# Altium schematic sheet schematic.schdoc
size 307 x 218 mm; Symbol: Drawing-Symbol_A4; Device: Drawing-Symbol_A4; @Project Name: SophiePart1; @Page Count: 1; @Update Date: 2025-06-26; @Create Date: 2025-06-23; @Schematic Name: Schematic1; @Page No: 1; @Page Name: P1; Company: EasyEDA.com; Version: V1.0; Page Size: A4; @Create Time: 17:08:23; @Update Time: 13:48:41; Width: 1170; Height: 825; Region Start: 1; X Region Count: 6; Y Region Count: 4; Blade Width: 10; Title Block Position: 3; @Board Name: Board1
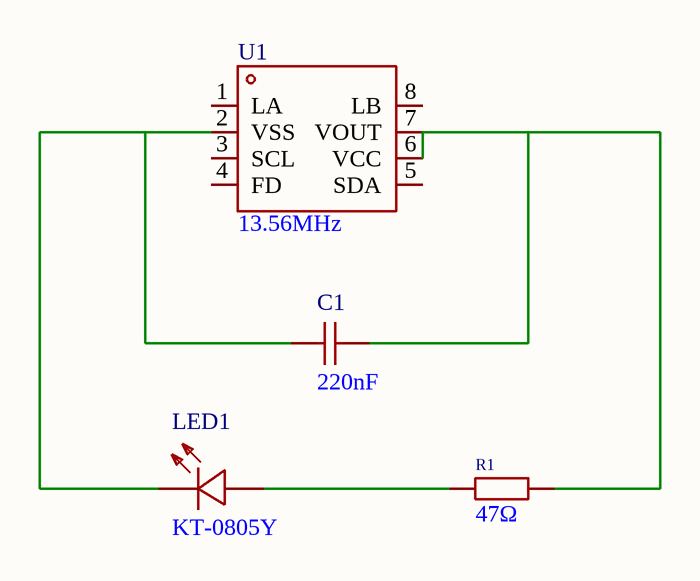
[diagram p0: schematic.schdoc]

## Parts
C1  220nF  [C0603]
LED1  KT-0805Y  [LED0805-R-RD]
R1  47Ω  [R0603]
U1  13.56MHz  [XQFN-8_L1.6-W1.6-P0.50-BL_NT3H2111W0FHKH]

## Nets
NetC1_1: C1.1 LED1.2(-) U1.2(VSS)
NetC1_2: C1.2 R1.2 U1.6(VCC) U1.7(VOUT)
NetLED1_1: LED1.1(+) R1.1

Not connected (* = marked no-connect by the designer): U1 1(LA) 3(SCL) 4(FD) 5(SDA) 8(LB)

## Notes on the sheet
- 1
- 2
- 3
- 4
- 5
- 6
- A
- B
- C
- Schematic
- Schematic1
- Create at
- Update at
- 2025-06-23
- 2025-06-26
- Board
- Drawn
- Board1
- Page
- P1
- D
- Reviewed
- Version
- Size
- SophiePart1
- Page  1  Total  1
- V1.0
- A4
- EasyEDA.com

## Library data of the parts
C1 = CL10B224KA8NNNC: Manufacturer: SAMSUNG(三星); Add into BOM: yes; Tolerance: ±10%; Symbol: CL10B224KA8NNNC; Device: CL10B224KA8NNNC; LCSC Part Name: 220nF ±10% 25V; Supplier Part: C21120; Manufacturer Part: CL10B224KA8NNNC; Supplier Footprint: 0603; JLCPCB Part Class: Basic Part; Datasheet: https://atta.szlcsc.com/upload/public/pdf/source/20160218/1457707763339.pdf; Supplier: LCSC; Convert to PCB: yes; Value: 220nF
LED1 = KT-0805Y: Manufacturer: KENTO; Symbol: 17-21SUYC/TR8; Add into BOM: yes; Emitted Color: Yellow; Device: KT-0805Y; LCSC Part Name: 0805 黄灯 高亮; Supplier Part: C2296; Manufacturer Part: KT-0805Y; Supplier Footprint: 0805; JLCPCB Part Class: Basic Part; Datasheet: https://atta.szlcsc.com/upload/public/pdf/source/20160421/1461205044170.pdf; Supplier: LCSC; Convert to PCB: yes; Power Dissipation: -; Forward Current: -; Dominant Wavelength: -; Peak Wavelength: -; Diode Configuration: -; Lens Color: -; Color Temperature: -; Viewing Angle: -; Mounting Sytle: -; Operating Temperature: -
R1 = 0603WAF470JT5E: Manufacturer: UNI-ROYAL(厚声); Add into BOM: yes; Tolerance: ±1%; Temperature Coefficient: ±100ppm/℃; Symbol: 0603WAF470JT5E; Device: 0603WAF470JT5E; Supplier: LCSC; Manufacturer Part: 0603WAF470JT5E; Supplier Part: C23182; Value: 47Ω; JLCPCB Part Class: Basic Part; LCSC Part Name: 47Ω ±1% 100mW 厚膜电阻; Supplier Footprint: 0603; Datasheet: https://atta.szlcsc.com/upload/public/pdf/source/20200306/C422600_1E6D84923E4A46A82E41ADD87F860B5C.pdf; Convert to PCB: yes; Type: Thick Film Resistors; Operating Temperature Range: -55℃~+155℃
U1 = NT3H2111W0FHKH: Manufacturer: NXP(恩智浦); Add into BOM: yes; agreement: ISO 14443; interface type: I2C; mains input: 3.3V; Symbol: NT3H2111W0FHKH; Device: NT3H2111W0FHKH; LCSC Part Name: NT3H2111W0FHKH; Supplier Part: C710403; Manufacturer Part: NT3H2111W0FHKH; Supplier Footprint: XQFN-8(1.6x1.6); JLCPCB Part Class: Extended Part; Datasheet: https://www.nxp.com/docs/en/data-sheet/NT3H2111_2211.pdf; Supplier: LCSC; Convert to PCB: yes; Value: 13.56MHz